# Altium schematic sheet Tile0.SchDoc
size A4
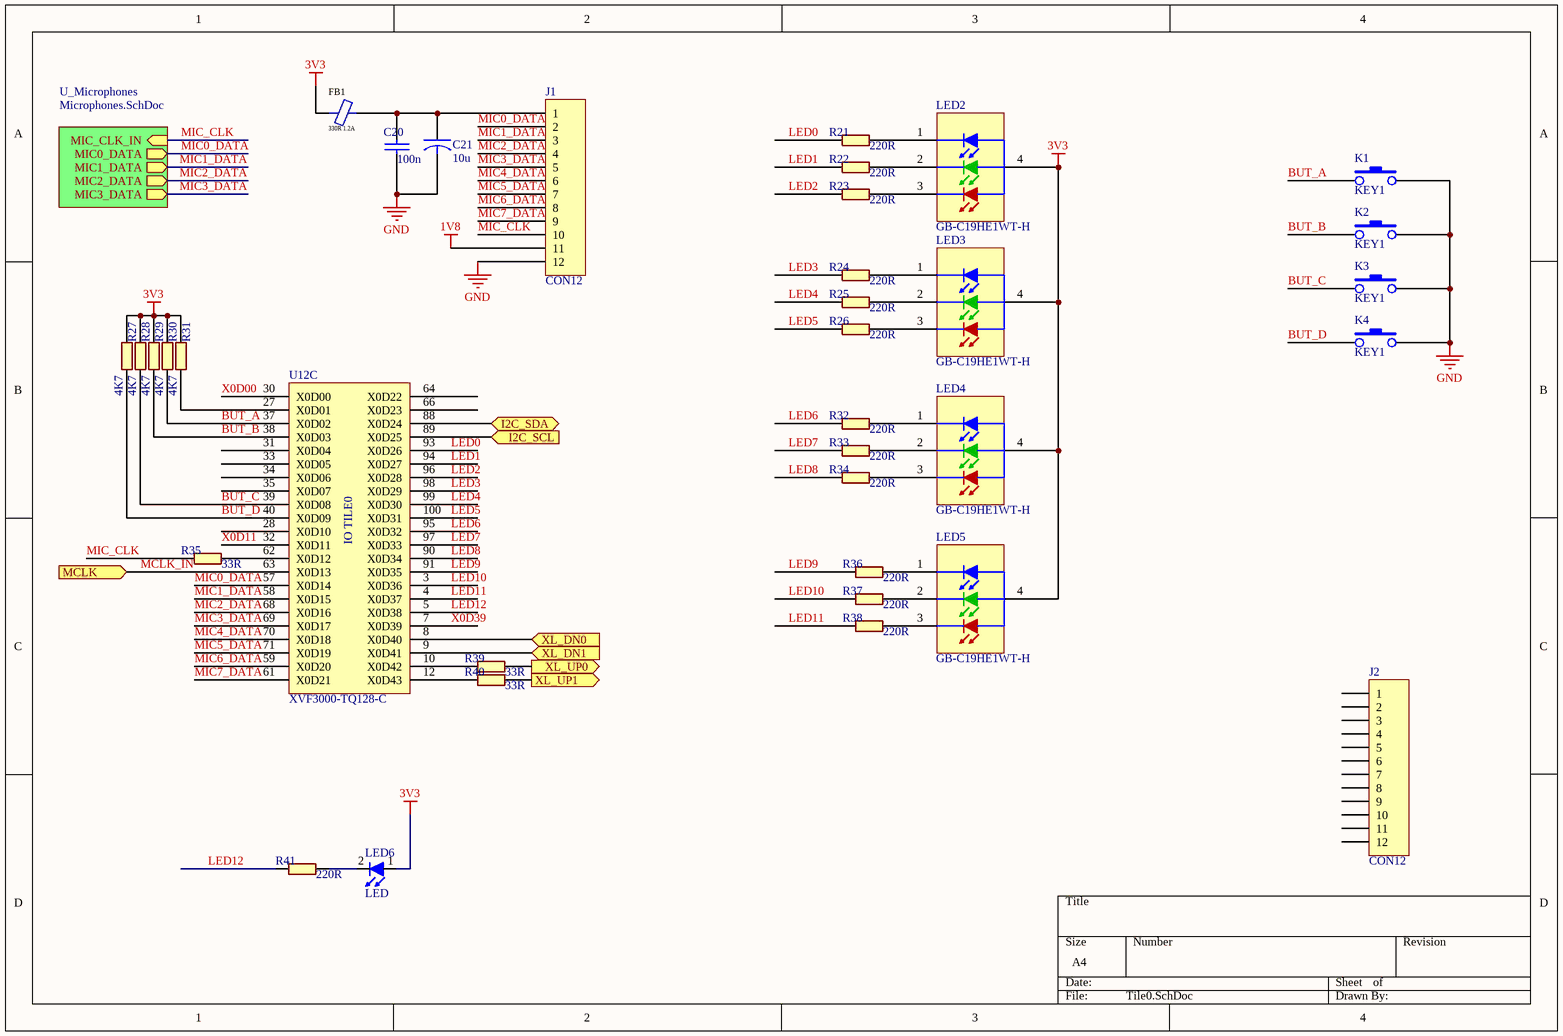
[diagram p0: Tile0.SchDoc]

## Parts
C20  100n  [C0603]
C21  10u  [C1206]
FB1  330R 1.2A  [L0603]
J1  CON12  [FFC/SM0.5-2H12A]
J2  CON12  [FFC/SM0.5-2H12A]
K1  KEY1  [BUTTON6]
K2  KEY1  [BUTTON6]
K3  KEY1  [BUTTON6]
K4  KEY1  [BUTTON6]
LED2  GB-C19HE1WT-H  [LED1615]
LED3  GB-C19HE1WT-H  [LED1615]
LED4  GB-C19HE1WT-H  [LED1615]
LED5  GB-C19HE1WT-H  [LED1615]
LED6  LED  [LED0805]
R21  220R  [R0603]
R22  220R  [R0603]
R23  220R  [R0603]
R24  220R  [R0603]
R25  220R  [R0603]
R26  220R  [R0603]
R27  4K7  [R0603]
R28  4K7  [R0603]
R29  4K7  [R0603]
R30  4K7  [R0603]
R31  4K7  [R0603]
R32  220R  [R0603]
R33  220R  [R0603]
R34  220R  [R0603]
R35  33R  [R0603]
R36  220R  [R0603]
R37  220R  [R0603]
R38  220R  [R0603]
R39  33R  [R0603]
R40  33R  [R0603]
R41  220R  [R0603]
U12  XVF3000-TQ128-C  [LQFP-128 - VSS]  (part C of 5)

## Sub-sheets
U_Microphones = Microphones.SchDoc: MIC_CLK_IN (in), MIC0_DATA (out), MIC1_DATA (out), MIC2_DATA (out), MIC3_DATA (out)

## Ports
I2C_SCL (in), I2C_SDA (bidir), MCLK (in), XL_DN0 (in), XL_DN1 (in), XL_UP0 (out), XL_UP1 (out)

## Nets
1V8: J1.11
3V3: FB1.2 LED2.4 LED3.4 LED4.4 LED5.4 LED6.1 R27.2 R28.2 R29.2 R30.2 R31.2
GND: C20.2 C21.2 J1.12 K1.2 K2.2 K3.2 K4.2
BUT_A: K1.1 R30.1 U12.37(X0D02)
BUT_B: K2.1 R29.1 U12.38(X0D03)
BUT_C: K3.1 R28.1 U12.39(X0D08)
BUT_D: K4.1 R27.1 U12.40(X0D09)
I2C_SCL: U12.89(X0D25) ; port I2C_SCL
I2C_SDA: U12.88(X0D24) ; port I2C_SDA
LED0: R21.2 U12.93(X0D26)
LED1: R22.2 U12.94(X0D27)
LED2: R23.2 U12.96(X0D28)
LED3: R24.2 U12.98(X0D29)
LED4: R25.2 U12.99(X0D30)
LED5: R26.2 U12.100(X0D31)
LED6: R32.2 U12.95(X0D32)
LED7: R33.2 U12.97(X0D33)
LED8: R34.2 U12.90(X0D34)
LED9: R36.2 U12.91(X0D35)
LED10: R37.2 U12.3(X0D36)
LED11: R38.2 U12.4(X0D37)
LED12: R41.2 U12.5(X0D38)
MCLK_IN: U12.63(X0D13) ; port MCLK
MIC0_DATA: J1.2 U12.57(X0D14) ; sheet U_Microphones/MIC0_DATA
MIC1_DATA: J1.3 U12.58(X0D15) ; sheet U_Microphones/MIC1_DATA
MIC2_DATA: J1.4 U12.68(X0D16) ; sheet U_Microphones/MIC2_DATA
MIC3_DATA: J1.5 U12.69(X0D17) ; sheet U_Microphones/MIC3_DATA
MIC4_DATA: J1.6 U12.70(X0D18)
MIC5_DATA: J1.7 U12.71(X0D19)
MIC6_DATA: J1.8 U12.59(X0D20)
MIC7_DATA: J1.9 U12.61(X0D21)
MIC_CLK: J1.10 R35.2 ; sheet U_Microphones/MIC_CLK_IN
X0D00: U12.30(X0D00)
X0D11: U12.32(X0D11)
X0D39: U12.7(X0D39)
XL_DN0: U12.8(X0D40) ; port XL_DN0
XL_DN1: U12.9(X0D41) ; port XL_DN1
XL_UP0: R39.1 ; port XL_UP0
XL_UP1: R40.1 ; port XL_UP1
NetC20_1: C20.1 C21.1 FB1.1 J1.1
NetLED2_1: LED2.1 R21.1
NetLED2_2: LED2.2 R22.1
NetLED2_3: LED2.3 R23.1
NetLED3_1: LED3.1 R24.1
NetLED3_2: LED3.2 R25.1
NetLED3_3: LED3.3 R26.1
NetLED4_1: LED4.1 R32.1
NetLED4_2: LED4.2 R33.1
NetLED4_3: LED4.3 R34.1
NetLED5_1: LED5.1 R36.1
NetLED5_2: LED5.2 R37.1
NetLED5_3: LED5.3 R38.1
NetLED6_2: LED6.2 R41.1
NetR31_1: R31.1 U12.27(X0D01)
NetR35_1: R35.1 U12.62(X0D12)
NetR39_2: R39.2 U12.10(X0D42)
NetR40_2: R40.2 U12.12(X0D43)

Not connected (* = marked no-connect by the designer): J2 1 2 3 4 5 6 7 8 9 10 11 12; U12 28(X0D10) 31(X0D04) 33(X0D05) 34(X0D06) 35(X0D07) 64(X0D22) 66(X0D23)

## Notes on the sheet
- (in symbol XVF3000-TQ128-C, part C) IO TILE0

## Library data of the parts
C20 = CAP: Capacitor
C21 = CAPACITOR
FB1 = FB
J1 J2 = CON12: Connector
K1-K4 = BUTTON
LED2-LED5 = LED-1615: LED RGB
R21-R41 = R: RES